# EasyEDA Pro project ProProject_无线温湿度检测系统1_2024-10-27.epro, schematic Schematic7
Create Date: 2024-02-25; Page Name: P1; Project Name: 无线温湿度检测系统1; Schematic Name: Schematic7; Update Date: 2024-03-22; Company: 嘉立创EDA; Page Size: A4; Version: V1.0
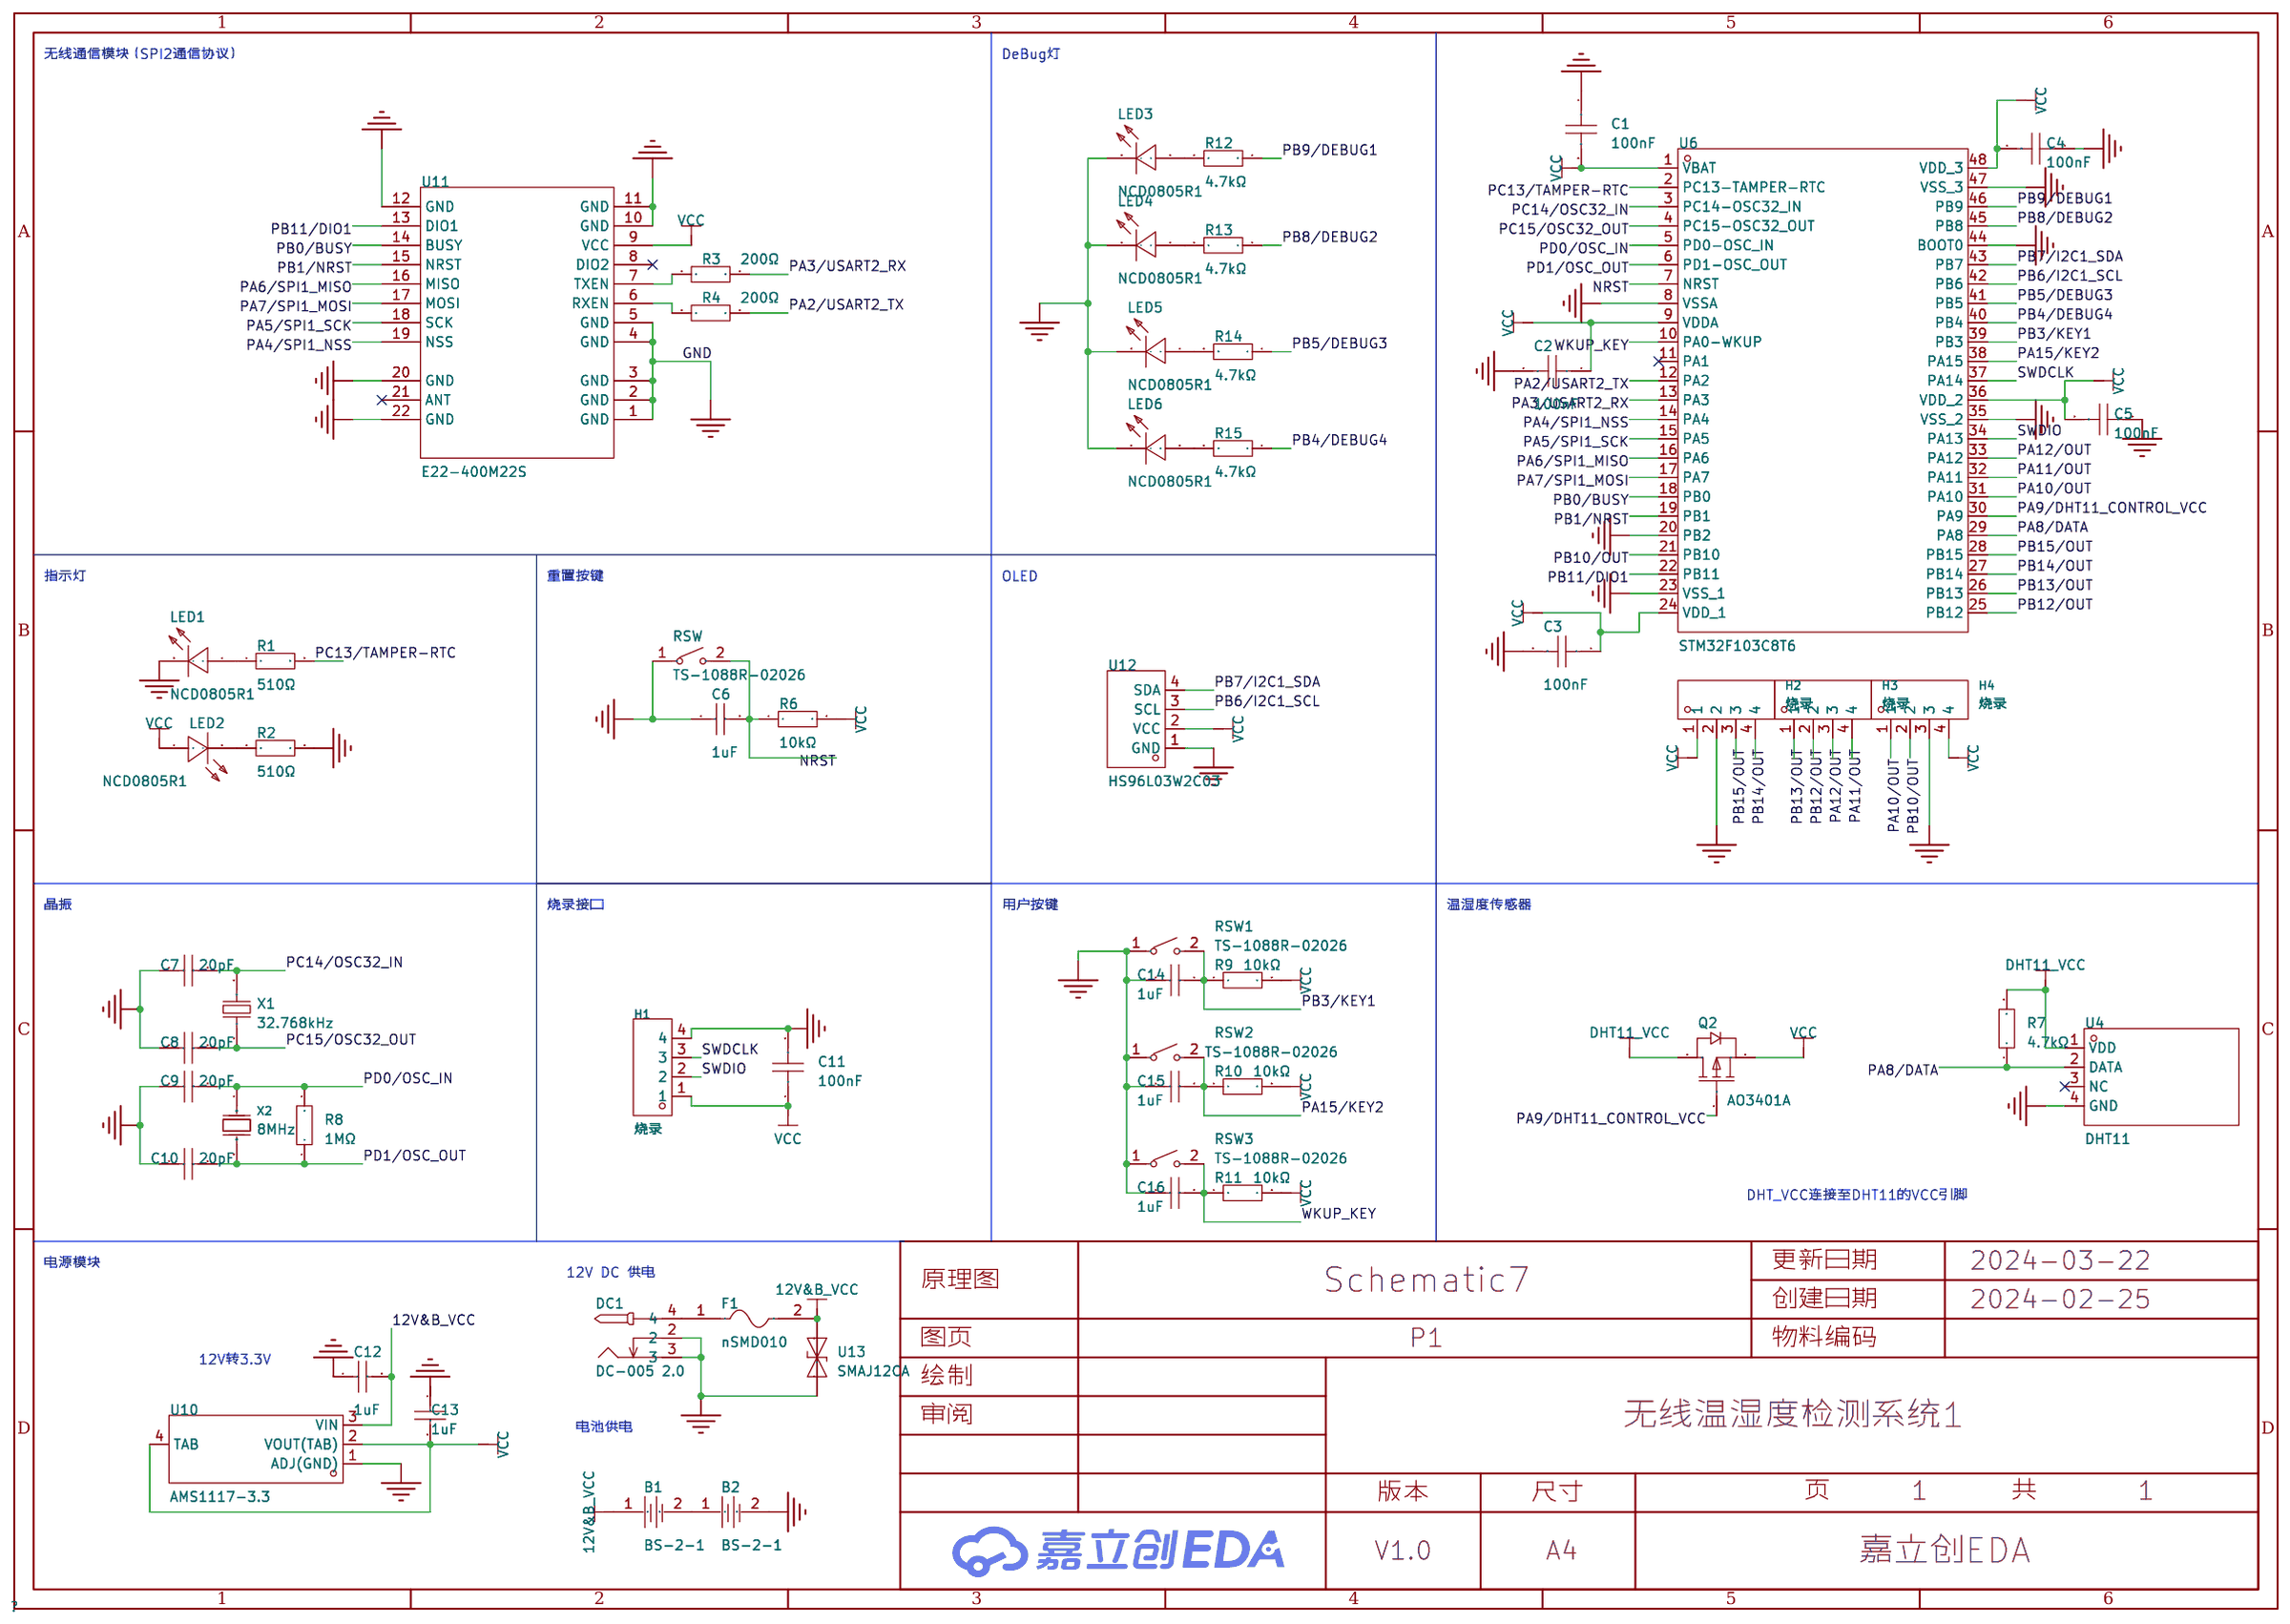
[diagram p3: schematic sheet]

## Parts
B1  BS-2-1  [BAT-TH_BS-2-1]
B2  BS-2-1  [BAT-TH_BS-2-1]
C1  100nF  [C0603]
C2  100nF  [C0603]
C3  100nF  [C0603]
C4  100nF  [C0603]
C5  100nF  [C0603]
C6  1uF  [C0603]
C7  20pF  [C0603]
C8  20pF  [C0603]
C9  20pF  [C0603]
C10  20pF  [C0603]
C11  100nF  [C0603]
C12  1uF  [C0603]
C13  1uF  [C0603]
C14  1uF  [C0603]
C15  1uF  [C0603]
C16  1uF  [C0603]
DC1  DC-005 2.0  [DC-IN-TH_DC-5520-1]
F1  nSMD010  [F1206]
H1  烧录  [HDR-TH_4P-P2.54-V-M]
H2  烧录  [HDR-TH_4P-P2.54-V-M]
H3  烧录  [HDR-TH_4P-P2.54-V-M]
H4  烧录  [HDR-TH_4P-P2.54-V-M]
LED1  NCD0805R1  [LED0805-R-RD]
LED2  NCD0805R1  [LED0805-R-RD]
LED3  NCD0805R1  [LED0805-R-RD]
LED4  NCD0805R1  [LED0805-R-RD]
LED5  NCD0805R1  [LED0805-R-RD]
LED6  NCD0805R1  [LED0805-R-RD]
Q2  AO3401A  [SOT-23_L2.9-W1.3-P1.90-LS2.4-BR]
R1  510Ω  [R0603]
R2  510Ω  [R0603]
R3  200Ω  [R0603]
R4  200Ω  [R0603]
R6  10kΩ  [R0603]
R7  4.7kΩ  [R0603]
R8  1MΩ  [R0603]
R9  10kΩ  [R0603]
R10  10kΩ  [R0603]
R11  10kΩ  [R0603]
R12  4.7kΩ  [R0603]
R13  4.7kΩ  [R0603]
R14  4.7kΩ  [R0603]
R15  4.7kΩ  [R0603]
RSW  TS-1088R-02026  [SW-SMD_L3.9-W3.0-P4.45]
RSW1  TS-1088R-02026  [SW-SMD_L3.9-W3.0-P4.45]
RSW2  TS-1088R-02026  [SW-SMD_L3.9-W3.0-P4.45]
RSW3  TS-1088R-02026  [SW-SMD_L3.9-W3.0-P4.45]
U4  DHT11  [SENSOR-TH_DHT11]
U6  STM32F103C8T6  [LQFP-48_L7.0-W7.0-P0.50-LS9.0-BL]
U10  AMS1117-3.3  [SOT-223-4_L6.5-W3.5-P2.30-LS7.0-BR]
U11  E22-400M22S  [WIRELM-SMD_E22-400M22S]
U12  HS96L03W2C03  [OLED-TH_L27.8-W27.2-P2.54_C9900033791]
U13  SMAJ12CA  [SMA_L4.3-W2.7-LS5.1-BI]
X1  32.768kHz  [FC-135R_L3.2-W1.5]
X2  8MHz  [CRYSTAL-SMD_L11.5-W4.8-LS12.7]

## Library data of the parts
B1 B2 = BS-2-1_C70376: 连接器类型:电池底座;适用电池规格:-;工作温度范围:-55℃~+85℃;; LCSC Part Name: 电池底座; Supplier Part: C70376; Manufacturer: Q&J; Supplier Footprint: 插件; JLCPCB Part Class: 扩展库; Datasheet: https://atta.szlcsc.com/upload/public/pdf/source/20160427/1461725216526.pdf; Supplier: LCSC; Connector Type: 电池底座; Operating Temperature Range: -55℃~+85℃
C1-C5 C11 = CC0603KRX7R9BB104: 容值:100nF;精度:±10%;额定电压:50V;材质(温度系数):X7R;; LCSC Part Name: 100nF ±10% 50V; Supplier Part: C14663; Manufacturer: YAGEO(国巨); Supplier Footprint: 0603; JLCPCB Part Class: Basic Part; Datasheet: https://atta.szlcsc.com/upload/public/pdf/source/20180910/C282072_33301C7F631E79921B82A8DAC6BCC5B3.pdf; Supplier: LCSC; Tolerance: ±10%; Voltage Rated: 50V; Temperature Coefficient: X7R
C6 C12-C16 = CL10A105KB8NNNC: 容值:1uF;精度:±10%;额定电压:50V;材质(温度系数):X5R;; LCSC Part Name: 1uF ±10% 50V; Supplier Part: C15849; Manufacturer: SAMSUNG(三星); Supplier Footprint: 0603; JLCPCB Part Class: Basic Part; Datasheet: https://atta.szlcsc.com/upload/public/pdf/source/20160103/1457707679084.pdf; Supplier: LCSC; Tolerance: ±10%; Voltage Rated: 50V; Temperature Coefficient: X5R
C7-C10 = CC0603JRNPO9BN200: 容值:20pF;精度:±5%;额定电压:50V;材质(温度系数):NP0;; LCSC Part Name: 20pF ±5% 50V; Supplier Part: C105621; Manufacturer: YAGEO(国巨); Supplier Footprint: 0603; JLCPCB Part Class: Extended Part; Datasheet: https://atta.szlcsc.com/upload/public/pdf/source/20170425/1493115771885.pdf; Supplier: LCSC; Tolerance: ±5%; Voltage Rated: 50V; Temperature Coefficient: NP0
DC1 = DC-005 2.0: 连接器类型:DC电源插座;安装方式:弯插;触点内径:2mm;触点外径:6.4mm;额定电流:-;额定电压:-;工作温度范围:-;; LCSC Part Name: DC电源插座 内径:2mm 外径:6.4mm 铁材质; Supplier Part: C16214; Manufacturer: BOOMELE(博穆精密); Supplier Footprint: 插件; JLCPCB Part Class: 扩展库; Datasheet: https://atta.szlcsc.com/upload/public/pdf/source/20190827/C16214_DA59F99E888FED58D9833F5341D610B0.pdf; Supplier: LCSC; Connector Type: DC电源插座; Mounting Style: 弯插; Inside Contact Diameter: 2mm; Outside Contact Diameter: 6.4mm
F1 = nSMD010: 最大电压:60V;最大电流:40A;保持电流:100mA;跳闸电流:250mA;; LCSC Part Name: 0.10A 60V 自恢复保险丝; Supplier Part: C70065; Manufacturer: 台湾陆海; Supplier Footprint: 1206; JLCPCB Part Class: 扩展库; Datasheet: https://atta.szlcsc.com/upload/public/pdf/source/20230404/ADB19886462D98F83AD677B1F8114E76.pdf; Supplier: LCSC; Operating Voltage (Max): 60V; Current Rating (Max): 40A; Hold Current: 100mA; Trip Current: 250mA; Power Dissipation: -；-；-；-; Operating Temperature: -40℃~+85℃
H1-H4 = PZ254V-11-04P: 排数:单排;总PIN位数:4P;间距:2.54mm;插针结构:1x4P;行距:-;安装类型:直插;圆针/方针:方针;额定电流:3A;额定电压:250V;配合针长度:6mm;塑高:2.5mm;端接针长度:3mm;触头材质:-;工作温度范围:-40℃~+105℃;颜色:黑色;; LCSC Part Name: 2.54mm 1x4P 直插 方针; Supplier Part: C2691448; Manufacturer: XFCN(兴飞); Supplier Footprint: 插件,P=2.54mm; JLCPCB Part Class: Extended Part; Datasheet: https://atta.szlcsc.com/upload/public/pdf/source/20200309/C492403_F9F19131791D08044AD4F84F8E751A34.pdf; Supplier: LCSC; Number of Rows: 单排; Number of Pins: 4P; Pitch: 2.54mm; Pin Structure: 1x4P; Mounting Type: 直插; Circluar Pins/Square Pins: 方针; Current Rating (Max): 3A; Voltage Rating (Max): 250V; Length of Mating Pin: 6mm; Insulation Height: 2.5mm; Length of End Connection Pin: 3mm; Operating Temperature Range: -40℃~+105℃; Color: 黑色
LED1-LED6 = NCD0805R1: 发光颜色:红灯;; LCSC Part Name: 红灯; Supplier Part: C84256; Manufacturer: 国星光电; Supplier Footprint: 0805; JLCPCB Part Class: Basic Part; Datasheet: https://atta.szlcsc.com/upload/public/pdf/source/20200820/C84256_F0A75A43B3EAD75808600A0514C76B99.pdf; Supplier: LCSC; Emitted Color: 红灯
Q2 = AO3401A_C15127: 类型:P沟道;漏源电压(Vdss):30V;连续漏极电流(Id):4A;功率(Pd):1.4W;导通电阻(RDS(on)@Vgs,Id):44mΩ@10V,4.3A;; LCSC Part Name: P沟道 30V 4A; Supplier Part: C15127; Manufacturer: AOS; Supplier Footprint: SOT-23-3L; JLCPCB Part Class: 基础库; Datasheet: https://atta.szlcsc.com/upload/public/pdf/source/20160507/1462613609053.pdf; Supplier: LCSC; Type: P沟道; Drain Source Voltage (Vdss): 30V; Continuous Drain Current (Id): 4A; Power Dissipation (Pd): 1.4W; Drain Source On Resistance (RDS(on)@Vgs,Id): 44mΩ@10V,4.3A; Gate Threshold Voltage (Vgs(th)@Id): 1.3V@250uA
R1 R2 = 0603WAF5100T5E: 电阻类型:厚膜电阻;阻值:510Ω;精度:±1%;功率:100mW;; LCSC Part Name: 510Ω ±1% 100mW; Supplier Part: C23193; Manufacturer: UNI-ROYAL(厚声); Supplier Footprint: 0603; JLCPCB Part Class: Basic Part; Datasheet: https://atta.szlcsc.com/upload/public/pdf/source/20200306/C422600_1E6D84923E4A46A82E41ADD87F860B5C.pdf; Supplier: LCSC; Type: 厚膜电阻; Tolerance: ±1%; Power(Watts): 100mW; Temperature Coefficient: ±100ppm/℃; Overload Voltage (Max): 75V; Operating Temperature Range: -55℃~+155℃
R3 R4 = 0603WAF2000T5E: 电阻类型:厚膜电阻;阻值:200Ω;精度:±1%;功率:100mW;温度系数:±100ppm/℃;; LCSC Part Name: 厚膜电阻 200Ω ±1% 100mW; Supplier Part: C8218; Manufacturer: UNI-ROYAL(厚声); Supplier Footprint: 0603; JLCPCB Part Class: 基础库; Datasheet: https://atta.szlcsc.com/upload/public/pdf/source/20200306/C422600_1E6D84923E4A46A82E41ADD87F860B5C.pdf; Supplier: LCSC; Type: 厚膜电阻; Tolerance: ±1%; Power(Watts): 100mW; Temperature Coefficient: ±100ppm/℃; Overload Voltage (Max): 75V; Operating Temperature Range: -55℃~+155℃
R6 R9-R11 = 0603WAF1002T5E: 电阻类型:厚膜电阻;阻值:10kΩ;精度:±1%;功率:100mW;; LCSC Part Name: 厚膜电阻 10kΩ ±1% 100mW; Supplier Part: C25804; Manufacturer: UNI-ROYAL(厚声); Supplier Footprint: 0603; JLCPCB Part Class: 基础库; Datasheet: https://atta.szlcsc.com/upload/public/pdf/source/20200306/C422600_1E6D84923E4A46A82E41ADD87F860B5C.pdf; Supplier: LCSC; Type: 厚膜电阻; Tolerance: ±1%; Power(Watts): 100mW; Temperature Coefficient: ±100ppm/℃; Overload Voltage (Max): 75V; Operating Temperature Range: -55℃~+155℃
R7 R12-R15 = 0603WAF4701T5E: 电阻类型:厚膜电阻;阻值:4.7kΩ;精度:±1%;功率:100mW;温度系数:±100ppm/℃;; LCSC Part Name: 厚膜电阻 4.7kΩ ±1% 100mW; Supplier Part: C23162; Manufacturer: UNI-ROYAL(厚声); Supplier Footprint: 0603; JLCPCB Part Class: 基础库; Datasheet: https://atta.szlcsc.com/upload/public/pdf/source/20200306/C422600_1E6D84923E4A46A82E41ADD87F860B5C.pdf; Supplier: LCSC; Type: 厚膜电阻; Tolerance: ±1%; Power(Watts): 100mW; Temperature Coefficient: ±100ppm/℃; Overload Voltage (Max): 75V; Operating Temperature Range: -55℃~+155℃
R8 = 0603WAF1004T5E: 电阻类型:厚膜电阻;阻值:1MΩ;精度:±1%;功率:100mW;最大工作电压:75V;温度系数:±100ppm/℃;; LCSC Part Name: 1MΩ ±1% 100mW 厚膜电阻; Supplier Part: C22935; Manufacturer: UNI-ROYAL(厚声); Supplier Footprint: 0603; JLCPCB Part Class: 基础库; Datasheet: https://atta.szlcsc.com/upload/public/pdf/source/20200306/C422600_1E6D84923E4A46A82E41ADD87F860B5C.pdf; Supplier: LCSC; Type: 厚膜电阻; Tolerance: ±1%; Power(Watts): 100mW; Overload Voltage (Max): 75V; Temperature Coefficient: ±100ppm/℃; Operating Temperature Range: -55℃~+155℃
RSW RSW1-RSW3 = TS-1088R-02026: 触点电流:50mA;额定电压(DC):12V;电路结构:单刀单掷;安装方式:立贴;带灯:-;机械寿命:-;; LCSC Part Name: 3.9*2.93*2mm 立贴 轻触开关; Supplier Part: C455280; Manufacturer: XUNPU(讯普); Supplier Footprint: SMD,3x4mm; JLCPCB Part Class: Extended Part; Datasheet: https://atta.szlcsc.com/upload/public/pdf/source/20191118/C455280_718CC4284DAF75EEB0AC8229AE7E40C5.pdf; Supplier: LCSC; Contact Current: 50mA; Voltage Rating (DC): 12V; Circuit: 单刀单掷; Mounting Style: 立贴; Actuator Style: 圆形按钮; Switch Length: 3.9mm; Switch Width: 2.93mm; Switch Height: 2mm
U4 = DHT11: 新款电容式数字温湿度传感器,老款已停产16.1x12.6x5.8mm; LCSC Part Name: DHT11  电容式传感器; Supplier Part: C117051; Manufacturer: 广州奥松; Supplier Footprint: SIP-4; JLCPCB Part Class: 扩展库; Datasheet: https://atta.szlcsc.com/upload/public/pdf/source/20170703/1499081238365.pdf; Supplier: LCSC
U6 = STM32F103C8T6: CPU内核:ARM Cortex-M3;CPU最大主频:72MHz;工作电压范围:2V~3.6V;程序存储容量:64KB;程序存储器类型:FLASH;RAM总容量:20KB;GPIO端口数量:37;; LCSC Part Name: STM32F103C8T6 MSL=3; Supplier Part: C8734; Manufacturer: ST(意法半导体); Supplier Footprint: LQFP-48(7x7); JLCPCB Part Class: 扩展库; Datasheet: https://atta.szlcsc.com/upload/public/pdf/source/20220812/8363ACEC51AD55ECEB84799464F7CB85.pdf; Supplier: LCSC; CPU Core: ARM Cortex-M3; CPU Maximum Speed: 72MHz; Operating Voltage Range: 2V~3.6V; Program Storage Size: 64KB; Program Memory Type: FLASH; RAM Size: 20KB; GPIO Ports Number: 37; ADC (Bit): 12bit; Universal Serial Bus: 有; Peripheral/Function: 看门狗；DMA；看门狗；片载温度传感器; Watchdog: 有; Infrared Data Association: 有; Low-Voltage Detect: 有; Direct Memory Access: 有; Internal Oscillator: 有; Operating Temperature Range: -40℃~+85℃
U10 = AMS1117-3.3_C347222: 输出类型:固定;输出极性:正;最大输入电压:18V;输出电压:3.3V;输出电流:1A;电源纹波抑制比(PSRR):60dB@(120Hz);; LCSC Part Name: 输入18V 输出3.3V 1A; Supplier Part: C347222; Manufacturer: UMW(友台半导体); Supplier Footprint: SOT-223; JLCPCB Part Class: 扩展库; Datasheet: https://atta.szlcsc.com/upload/public/pdf/source/20211011/50CC665C22E3A66C08379A4A74BDA25C.pdf; Supplier: LCSC; Output Type: 固定; Output Polarity: 正; Number of Outputs: 1; Maximum Input Voltage: 18V; Output Voltage: 3.3V; Dropout Voltage: 1.3V@(1A); Output Current: 1A; Power Supply Rejection Ratio (PSRR): 60dB@(120Hz)
U11 = E22-400M22S: SX1262|SX1268+PA新一代LoRa扩频433MHz/470M无线模块SX1278升级; Supplier Part: C411291; Manufacturer: EBYTE(亿佰特); Supplier Footprint: SMD,14.0x20mm; JLCPCB Part Class: 扩展库; Datasheet: https://atta.szlcsc.com/upload/public/pdf/source/20190812/C411291_90FD46F52AC63064ACAA22A31BCCA1DF.pdf; Supplier: LCSC
U12 = HS96L03W2C03: 尺寸(inch)：0.96寸 0.96' 像素分辨率：128x64 128*64主控芯片：SSD1315 接口类型：I2C 外形:27.3*27.8；IIC/3SPI/4SPI串口通讯,工作温度范围-40℃—+70℃。4PIN黑底白光。; LCSC Part Name: 0.96寸OLED显示屏窄白光IIC; Supplier Part: C5248080; Manufacturer: HS(汉昇); JLCPCB Part Class: 扩展库; Datasheet: https://atta.szlcsc.com/upload/public/pdf/source/20230627/763D01F79A90007632F098068C7C8AD9.pdf; Supplier: LCSC
U13 = SMAJ12CA_C3001959: 反向截止电压(Vrwm):12V;最大钳位电压:19.9V;峰值脉冲电流(Ipp)@10/1000us:20.1A;峰值脉冲功率(Ppp)@10/1000us:400W;击穿电压:13.3V;; LCSC Part Name: 双向TVS 12V截止 20.1A峰值脉冲; Supplier Part: C3001959; Manufacturer: UMW(友台半导体); Supplier Footprint: SMA(DO-214AC); JLCPCB Part Class: 扩展库; Datasheet: https://atta.szlcsc.com/upload/public/pdf/source/20220418/4D87B6D60C1DFB29493B09203CA0C822.pdf; Supplier: LCSC; Reverse Stand-Off Voltage (Vrwm): 12V; Maximum Clamping Voltage: 19.9V; Peak Pulse Current (Ipp)@10/1000us: 20.1A; Peak Pulse Power Dissipation (Ppp)@10/1000us: 400W; Breakdown Voltage: 13.3V; Reverse Leakage Current (Ir): 1uA; Type: TVS
X1 = Q13FC1350000400: 频率:32.768kHz;频率公差:±20ppm;负载电容:12.5pF;; LCSC Part Name: 32.768kHz ±20ppm 12.5pF; Supplier Part: C32346; Manufacturer: EPSON(爱普生); Supplier Footprint: SMD3215-2P; JLCPCB Part Class: Basic Part; Datasheet: https://atta.szlcsc.com/upload/public/pdf/source/20190108/C32346_746D6B07EAF90824457A96480007685F.pdf; Supplier: LCSC; Crystal Type: 贴片无源晶振; Frequency Tolerance: ±20ppm; Load Capacitance: 12.5pF; Equivalent Series Resistance (ESR): 70kΩ; Operating Temperature: -40℃~+85℃
X2 = X49SM8MSD2SC: 频率:8MHz;频率公差:±20ppm;负载电容:20pF;; LCSC Part Name: 8MHz ±20ppm 20pF HC-49SMD; Supplier Part: C12674; Manufacturer: YXC(扬兴晶振); Supplier Footprint: HC-49S-SMD; JLCPCB Part Class: Basic Part; Datasheet: https://atta.szlcsc.com/upload/public/pdf/source/20210329/C106809_0E91E60850A780B284B63D653DC40EA4.pdf; Supplier: LCSC; Crystal Type: 49SMD; Frequency Tolerance: ±20ppm; Frequency Stability: ±30ppm; Load Capacitance: 20pF; Operating Temperature: -20℃~+70℃

## Nets
12V&B_VCC: B1.1 C12.2 F1.2 U10.3(VIN) U13.2(A)
GND: B2.2 C1.1 C2.2 C3.2 C4.1 C5.1 C6.1 C7.1 C8.1 C9.1 C10.1 C11.2 C12.1 C13.1 C14.1 C15.1 C16.1 DC1.2 DC1.3 H1.4 H2.2 H4.3 LED1.2(-) LED3.2(-) LED4.2(-) LED5.2(-) LED6.2(-) R2.2 RSW.1 RSW1.1 RSW2.1 RSW3.1 U4.4(GND) U6.8(VSSA) U6.20(PB2) U6.23(VSS_1) U6.35(VSS_2) U6.44(BOOT0) U6.47(VSS_3) U10.1(ADJ(GND)) U11.1(GND) U11.2(GND) U11.3(GND) U11.4(GND) U11.5(GND) U11.10(GND) U11.11(GND) U11.12(GND) U11.20(GND) U11.22(GND) U12.1(GND) U13.1(K)
VCC: C1.2 C2.1 C3.1 C4.2 C5.2 C11.1 C13.2 H1.1 H2.1 H4.4 LED2.1(+) Q2.2(S) R6.2 R9.2 R10.2 R11.2 U6.1(VBAT) U6.9(VDDA) U6.24(VDD_1) U6.36(VDD_2) U6.48(VDD_3) U10.2(VOUT(TAB)) U10.4(TAB) U11.9(VCC) U12.2(VCC)
DHT11_VCC: Q2.3(D) R7.2 U4.1(VDD)
NRST: C6.2 R6.1 RSW.2 U6.7(NRST)
PA2/USART2_TX: R4.2 U6.12(PA2)
PA3/USART2_RX: R3.2 U6.13(PA3)
PA4/SPI1_NSS: U6.14(PA4) U11.19(NSS)
PA5/SPI1_SCK: U6.15(PA5) U11.18(SCK)
PA6/SPI1_MISO: U6.16(PA6) U11.16(MISO)
PA7/SPI1_MOSI: U6.17(PA7) U11.17(MOSI)
PA8/DATA: R7.1 U4.2(DATA) U6.29(PA8)
PA9/DHT11_CONTROL_VCC: Q2.1(G) U6.30(PA9)
PA10/OUT: H4.1 U6.31(PA10)
PA11/OUT: H3.4 U6.32(PA11)
PA12/OUT: H3.3 U6.33(PA12)
PA15/KEY2: C15.2 R10.1 RSW2.2 U6.38(PA15)
PB0/BUSY: U6.18(PB0) U11.14(BUSY)
PB1/NRST: U6.19(PB1) U11.15(NRST)
PB3/KEY1: C14.2 R9.1 RSW1.2 U6.39(PB3)
PB4/DEBUG4: R15.1 U6.40(PB4)
PB5/DEBUG3: R14.1 U6.41(PB5)
PB6/I2C1_SCL: U6.42(PB6) U12.3(SCL)
PB7/I2C1_SDA: U6.43(PB7) U12.4(SDA)
PB8/DEBUG2: R13.1 U6.45(PB8)
PB9/DEBUG1: R12.1 U6.46(PB9)
PB10/OUT: H4.2 U6.21(PB10)
PB11/DIO1: U6.22(PB11) U11.13(DIO1)
PB12/OUT: H3.2 U6.25(PB12)
PB13/OUT: H3.1 U6.26(PB13)
PB14/OUT: H2.4 U6.27(PB14)
PB15/OUT: H2.3 U6.28(PB15)
PC13/TAMPER-RTC: R1.2 U6.2(PC13-TAMPER-RTC)
PC14/OSC32_IN: C7.2 U6.3(PC14-OSC32_IN) X1.2
PC15/OSC32_OUT: C8.2 U6.4(PC15-OSC32_OUT) X1.1
PD0/OSC_IN: C9.2 R8.2 U6.5(PD0-OSC_IN) X2.1(OSC1)
PD1/OSC_OUT: C10.2 R8.1 U6.6(PD1-OSC_OUT) X2.2(OSC2)
SWDCLK: H1.3 U6.37(PA14)
SWDIO: H1.2 U6.34(PA13)
WKUP_KEY: C16.2 R11.1 RSW3.2 U6.10(PA0-WKUP)
$1N1536: LED2.2(-) R2.1
$1N1721: R4.1 U11.6(RXEN)
$1N1727: R3.1 U11.7(TXEN)
$1N3357: LED4.1(+) R13.2
$1N4011: B1.2 B2.1
$1N22011: LED1.1(+) R1.1
$1N22868: LED3.1(+) R12.2
$1N22951: LED5.1(+) R14.2
$1N22990: LED6.1(+) R15.2
$1N24718: DC1.4 F1.1

Not connected (* = marked no-connect by the designer): U4 3(NC)*; U6 11(PA1)*; U11 8(DIO2)* 21(ANT)*

## Notes on the sheet
- 无线通信模块（SPI2通信协议）
- DeBug灯
- 指示灯
- 重置按键
- OLED
- 晶振
- 烧录接口
- 用户按键
- 温湿度传感器
- DHT_VCC连接至DHT11的VCC引脚
- 电源模块
- 12V DC 供电
- 12V转3.3V
- 电池供电
